# Altium project ValveTestr.PrjPcb
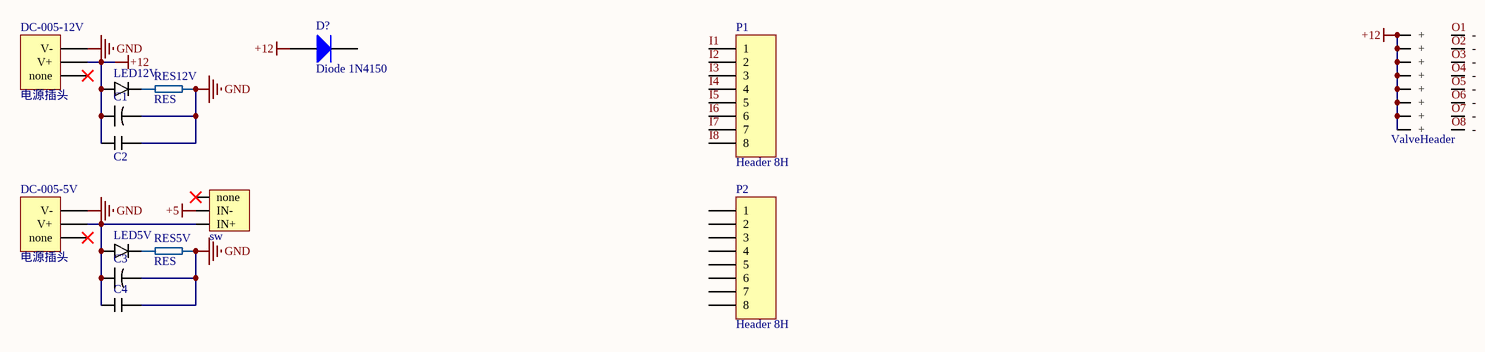
[diagram p0: Sheet1.SchDoc]
1 sheet, 22 parts. Net scope: global (net labels, ports and power ports of the same name join across sheets).
Board file: PCB1.PcbDoc

## Sheet Sheet1.SchDoc
size A4

### Parts
C1  C-po  [CAP1]  (value not drawn)
C2  C  [CAP2]  (value not drawn)
C3  C-po  [CAP1]  (value not drawn)
C4  C  [CAP2]  (value not drawn)
D?  Diode 1N4150  [DO-35]
DC-005-5V  电源插头  [DC-005]
DC-005-12V  电源插头  [DC-005]
LED5V  LED  [LED]  (value not drawn)
LED12V  LED  [LED]  (value not drawn)
P1  Header 8H  [HDR1X8H]
P2  Header 8H  [HDR1X8H]
RES5V  RES  [RES]
RES12V  RES  [RES]
sw  powSwitch  [powSwitch]  (value not drawn)
V1  ValveHeader  [ValveHeader]  (value not drawn)
V2  ValveHeader  [ValveHeader]  (value not drawn)
V3  ValveHeader  [ValveHeader]  (value not drawn)
V4  ValveHeader  [ValveHeader]  (value not drawn)
V5  ValveHeader  [ValveHeader]  (value not drawn)
V6  ValveHeader  [ValveHeader]  (value not drawn)
V7  ValveHeader  [ValveHeader]  (value not drawn)
V8  ValveHeader  [ValveHeader]

### Nets
+5: sw.IN-
+12: C1.C+ C2.C1 D?.1(A) DC-005-12V.V+ LED12V.1 V1.+ V2.+ V3.+ V4.+ V5.+ V6.+ V7.+ V8.+
GND: C1.C- C2.C2 C3.C- C4.C2 DC-005-5V.V- DC-005-12V.V- RES5V.R2 RES12V.R2
I1: P1.1
I2: P1.2
I3: P1.3
I4: P1.4
I5: P1.5
I6: P1.6
I7: P1.7
I8: P1.8
O1: V1.-
O2: V2.-
O3: V3.-
O4: V4.-
O5: V5.-
O6: V6.-
O7: V7.-
O8: V8.-
NetC3_C+: C3.C+ C4.C1 DC-005-5V.V+ LED5V.1 sw.IN+
NetLED5V_2: LED5V.2 RES5V.R1
NetLED12V_2: LED12V.2 RES12V.R1

Not connected (* = marked no-connect by the designer): D? 2(K); DC-005-5V none*; DC-005-12V none*; P2 1 2 3 4 5 6 7 8; sw none*

### Library data of the parts
D? = Diode 1N4150: High Conductance Ultra Fast Diode; Published: 8-Jun-2000; LatestRevisionDate: 17-Jul-2002; LatestRevisionNote: Re-released for DXP Platform.; DatasheetVersion: 1997; PackageReference: DO-35; Publisher: Altium Limited; PackageDescription: Diode, Axial; Body 3.8 x 1.9 mm (LxDia. max), Lead Dia. 0.53 mm (max); Code_JEDEC: DO-204-AH; ComponentLink1Description: Manufacturer Link; ComponentLink1URL: http://www.fairchildsemi.com/
DC-005-5V DC-005-12V = DC-005
P1 P2 = Header 8H: Header, 8-Pin, Right Angle; LatestRevisionDate: 17-Jul-2002; LatestRevisionNote: Re-released for DXP Platform.; Publisher: Altium Limited